# Altium project Full Bridge Rectifier Using OpAmp V1.0.PrjPcb
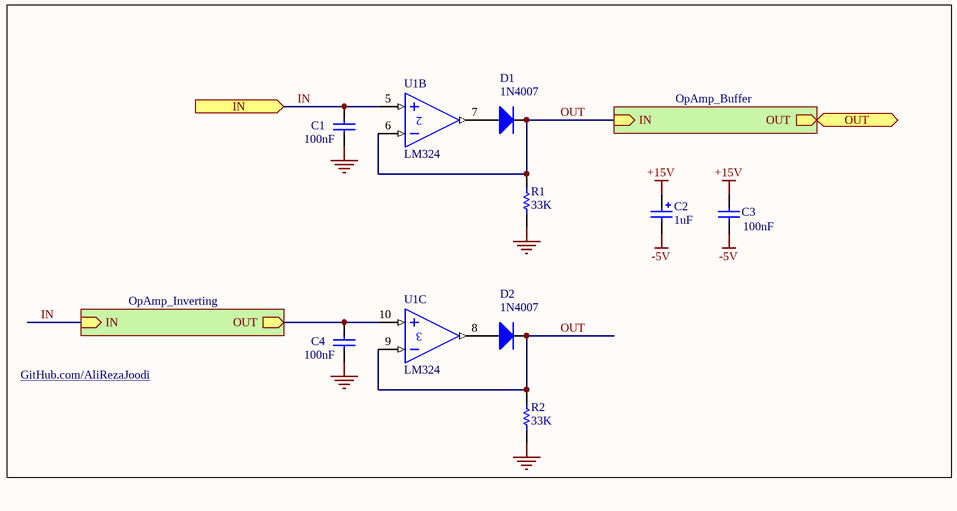
[diagram p0: Main.SchDoc]
3 sheets, 16 parts. Net scope: hierarchical (ports join the sheet entries above them; power ports are global).
Sheets:
  Main.SchDoc
    U_OpAmp_Inverting = OpAmp_Inverting.SchDoc
    U_OpAmp_Buffer = OpAmp_Buffer.SchDoc

## Sheet Main.SchDoc
size 177 x 88 mm

### Parts
C1  value 100nF  [0805]  (hidden comment: C?)
C2  value 1uF  [Cap_B]  (hidden comment: Capacitor)
C3  value 100nF  [0805]  (hidden comment: Cap)
C4  value 100nF  [0805]  (hidden comment: C?)
D1  1N4007  [MELF-D3516-1406]
D2  1N4007  [MELF-D3516-1406]
R1  value 33K  [0805]  (hidden comment: Res1)
R2  value 33K  [0805]  (hidden comment: Res1)
U1  LM324  [SOP127P636-14N]  (parts B,C of 5)

### Sub-sheets
U_OpAmp_Buffer = OpAmp_Buffer: OUT (out), IN (in)
U_OpAmp_Inverting = OpAmp_Inverting: OUT (out), IN (in)

### Ports
IN (in), OUT (out)

### Nets
+15V: C2.1 C3.1
-5V: C2.2 C3.2
GND: C1.2 C4.2 R1.1 R2.1
IN: C1.1 U1.5(IN+) ; port IN, sheet U_OpAmp_Inverting/IN
OUT: D1.2(K) D2.2(K) R1.2 R2.2 U1.6(IN-) U1.9(IN-) ; sheet U_OpAmp_Buffer/IN
NetC4_1: C4.1 U1.10(IN+) ; sheet U_OpAmp_Inverting/OUT
NetC5_1: port OUT, sheet U_OpAmp_Buffer/OUT
NetD1_1: D1.1(A) U1.7(OUT)
NetD2_1: D2.1(A) U1.8(OUT)

### Notes on the sheet
- GitHub.com/AliRezaJoodi

### Library data of the parts
C1 C4 = Cap: Capacitor; Manufacturer: Generic Components; Class I: Passive; Published: 8-Jun-2000; Revision: July-2002: Re-released for DXP Platform.; Publisher: Altium Limited; Class II: Capacitor
C2 = Cap Pol1: Polarized Capacitor (Radial); Manufacturer: Generic Components; Class I: Passive; Published: 8-Jun-2000; Revision: July-2002: Re-released for DXP Platform.; Publisher: Altium Limited; Class II: Capacitor
C3 = Cap: Capacitor; Published: 8-Jun-2000; LatestRevisionDate: 17-Jul-2002; LatestRevisionNote: Re-released for DXP Platform.; PackageReference: RAD-0.3; Publisher: Altium Limited
D1 D2 = Diode: Default Diode; Manufacturer: Generic Components; Class I: Discrete; Class II: Diode - Switching; Published: 8-Jun-2000; Revision: July-2002: Re-released for DXP Platform.; Publisher: Altium Limited
R1 R2 = Res1: Resistor; Published: 8-Jun-2000; LatestRevisionDate: 17-Jul-2002; LatestRevisionNote: Re-released for DXP Platform.; PackageReference: AXIAL-0.3; Publisher: Altium Limited
U1 = LM324: Quad Low-Power Operational Amplifier; Published: 17-Jul-2002; LatestRevisionDate: 06-Jun-2005; LatestRevisionNote: Stylized 3D Model Added.; DatasheetVersion: 1988; PackageVersion: 1997; PackageReference: 646-06; Publisher: Altium Limited; PackageDescription: DIP; 14 Leads; Row Spacing 7.62 mm; Pitch 2.54 mm; ComponentLink1Description: Manufacturer Link; ComponentLink1URL: http://www.onsemi.com/site/products/parametrics/0,4446,251,00.html; ComponentLink2Description: Datasheet; ComponentLink2URL: http://www.onsemi.com/pub/Collateral/LM324-D.PDF

## Sheet OpAmp_Inverting.SchDoc
size 76 x 30 mm
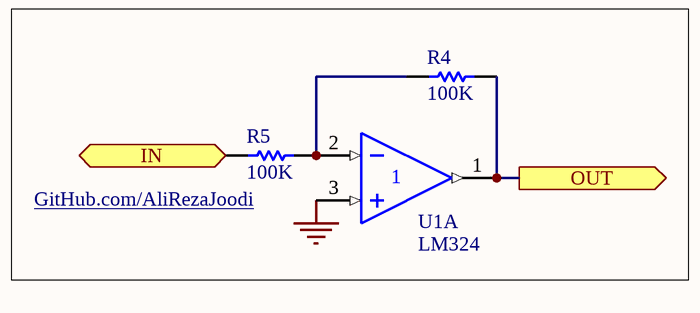
[diagram p1: OpAmp_Inverting.SchDoc]

### Parts
R4  100K  [AXIAL-0.4]
R5  100K  [AXIAL-0.4]
U1  LM324  [646-06]  (part A of 5)

### Ports
IN (in), OUT (out)

### Nets
GND: U1.3(IN+)
IN: R5.2 ; port IN
NetC4_1: R4.2 U1.1(OUT) ; port OUT
NetR4_1: R4.1 R5.1 U1.2(IN-)

### Notes on the sheet
- (near R5) GitHub.com/AliRezaJoodi

### Library data of the parts
R4 R5 = Res1: Resistor; Published: 8-Jun-2000; LatestRevisionDate: 17-Jul-2002; LatestRevisionNote: Re-released for DXP Platform.; PackageReference: AXIAL-0.3; Publisher: Altium Limited
U1 = LM324: Quad Low-Power Operational Amplifier; Published: 17-Jul-2002; LatestRevisionDate: 06-Jun-2005; LatestRevisionNote: Stylized 3D Model Added.; DatasheetVersion: 1988; PackageVersion: 1997; PackageReference: 646-06; Publisher: Altium Limited; PackageDescription: DIP; 14 Leads; Row Spacing 7.62 mm; Pitch 2.54 mm; ComponentLink1Description: Manufacturer Link; ComponentLink1URL: http://www.onsemi.com/site/products/parametrics/0,4446,251,00.html; ComponentLink2Description: Datasheet; ComponentLink2URL: http://www.onsemi.com/pub/Collateral/LM324-D.PDF

## Sheet OpAmp_Buffer.SchDoc
size 114 x 38 mm
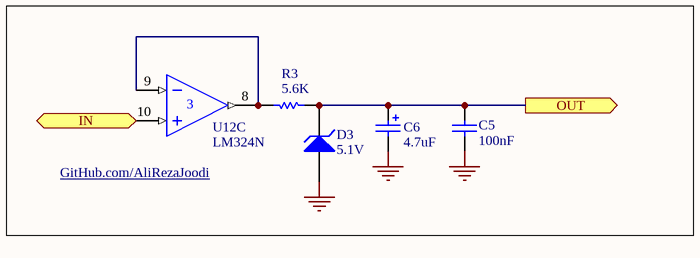
[diagram p2: OpAmp_Buffer.SchDoc]

### Parts
C5  value 100nF  [0805]  (hidden comment: Cap)
C6  value 4.7uF  [Cap_B]  (hidden comment: Capacitor)
D3  value 5.1V  [MELF-D3516-1406]  (hidden comment: D Zener)
R3  value 5.6K  [RESC3216N]  (hidden comment: Res1)
U12  LM324N  [SOP127P636-14N]  (part C of 4)

### Ports
IN (in), OUT (out)

### Nets
GND: C5.2 C6.2 D3.1(A)
OUT: U12.10(IN+) ; port IN
NetC5_1: C5.1 C6.1 D3.2(K) R3.1 ; port OUT
NetR3_2: R3.2 U12.8(OUT) U12.9(IN-)

### Notes on the sheet
- (near U12) GitHub.com/AliRezaJoodi

### Library data of the parts
C5 = Cap: Capacitor; Published: 8-Jun-2000; LatestRevisionDate: 17-Jul-2002; LatestRevisionNote: Re-released for DXP Platform.; PackageReference: RAD-0.3; Publisher: Altium Limited
C6 = Cap Pol1: as C2 on sheet Main; Published: 8-Jun-2000; Revision: July-2002: Re-released for DXP Platform.; Publisher: Altium Limited; Class II: Capacitor
D3 = D Zener: Zener Diode; Manufacturer: Generic Components; Class I: Discrete; Class II: Diode - Zener; Published: 8-Jun-2000; Revision: July-2002: Re-released for DXP Platform.; Publisher: Altium Limited
R3 = Res1: Resistor; Published: 8-Jun-2000; LatestRevisionDate: 17-Jul-2002; LatestRevisionNote: Re-released for DXP Platform.; PackageReference: AXIAL-0.3; Publisher: Altium Limited
U12 = LM324N: Quad Low-Power Operational Amplifier; Value: LM324; Published: 17-Jul-2002; LatestRevisionDate: 06-Jun-2005; LatestRevisionNote: Stylized 3D Model Added.; DatasheetVersion: 1988; PackageVersion: 1997; PackageReference: 646-06; Publisher: Altium Limited; PackageDescription: DIP; 14 Leads; Row Spacing 7.62 mm; Pitch 2.54 mm; ComponentLink1Description: Manufacturer Link; ComponentLink1URL: http://www.onsemi.com/site/products/parametrics/0,4446,251,00.html; ComponentLink2Description: Datasheet; ComponentLink2URL: http://www.onsemi.com/pub/Collateral/LM324-D.PDF

## Nets that join several sheets
GND: Main (C1.2 C4.2 R1.1 R2.1), OpAmp_Inverting (U1.3), OpAmp_Buffer (C5.2 C6.2 D3.1)
IN: Main (C1.1 U1.5), OpAmp_Inverting (R5.2)
NetC4_1: Main (C4.1 U1.10), OpAmp_Inverting (R4.2 U1.1)
OUT: Main (6 pins), OpAmp_Buffer (U12.10)